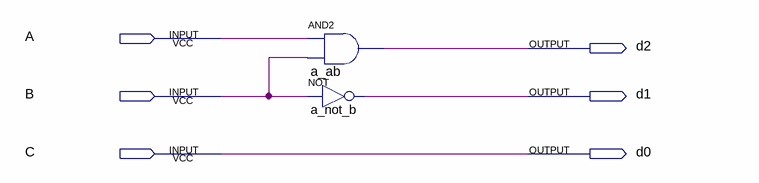
[diagram p0: schematic sheet]
// Quartus schematic a.bdf as structural Verilog: 2 symbols, 6 pins
module a (
  input  A,
  input  B,
  input  C,
  output d2,
  output d1,
  output d0
);

  and a_ab (d2, A, B);
  not a_not_b (d1, B);

  assign d0 = C;
endmodule
